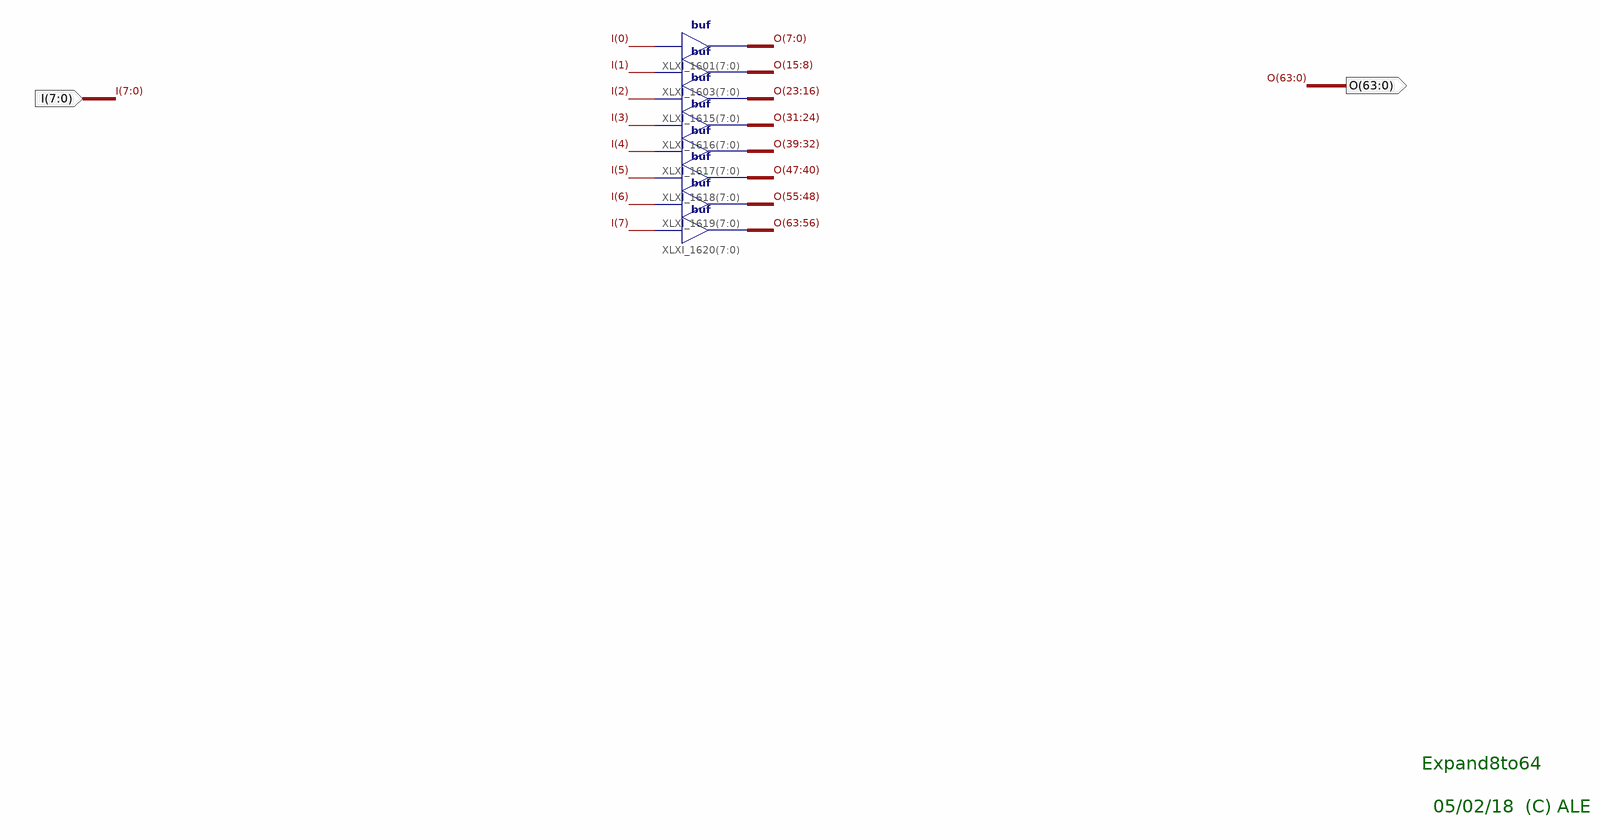
[diagram p0: schematic sheet 1]
// Xilinx ISE schematic Expand8to64.sch (zynq) as structural Verilog: 8 symbols, 2 ports
module Expand8to64 (
  input  [7:0] I,
  output [63:0] O
);

  assign O[31:24] = {8{I[3]}};  // buf XLXI_1616[7..0], 8 bits wide
  assign O[23:16] = {8{I[2]}};  // buf XLXI_1615[7..0], 8 bits wide
  assign O[15:8] = {8{I[1]}};  // buf XLXI_1603[7..0], 8 bits wide
  assign O[7:0] = {8{I[0]}};  // buf XLXI_1601[7..0], 8 bits wide
  assign O[63:56] = {8{I[7]}};  // buf XLXI_1620[7..0], 8 bits wide
  assign O[55:48] = {8{I[6]}};  // buf XLXI_1619[7..0], 8 bits wide
  assign O[47:40] = {8{I[5]}};  // buf XLXI_1618[7..0], 8 bits wide
  assign O[39:32] = {8{I[4]}};  // buf XLXI_1617[7..0], 8 bits wide

  // Notes on the sheet:
  //   Expand8to64
  //   05/02/18  (C) ALE
endmodule
